# Altium project lab2_demcheva_buck.PrjPcb
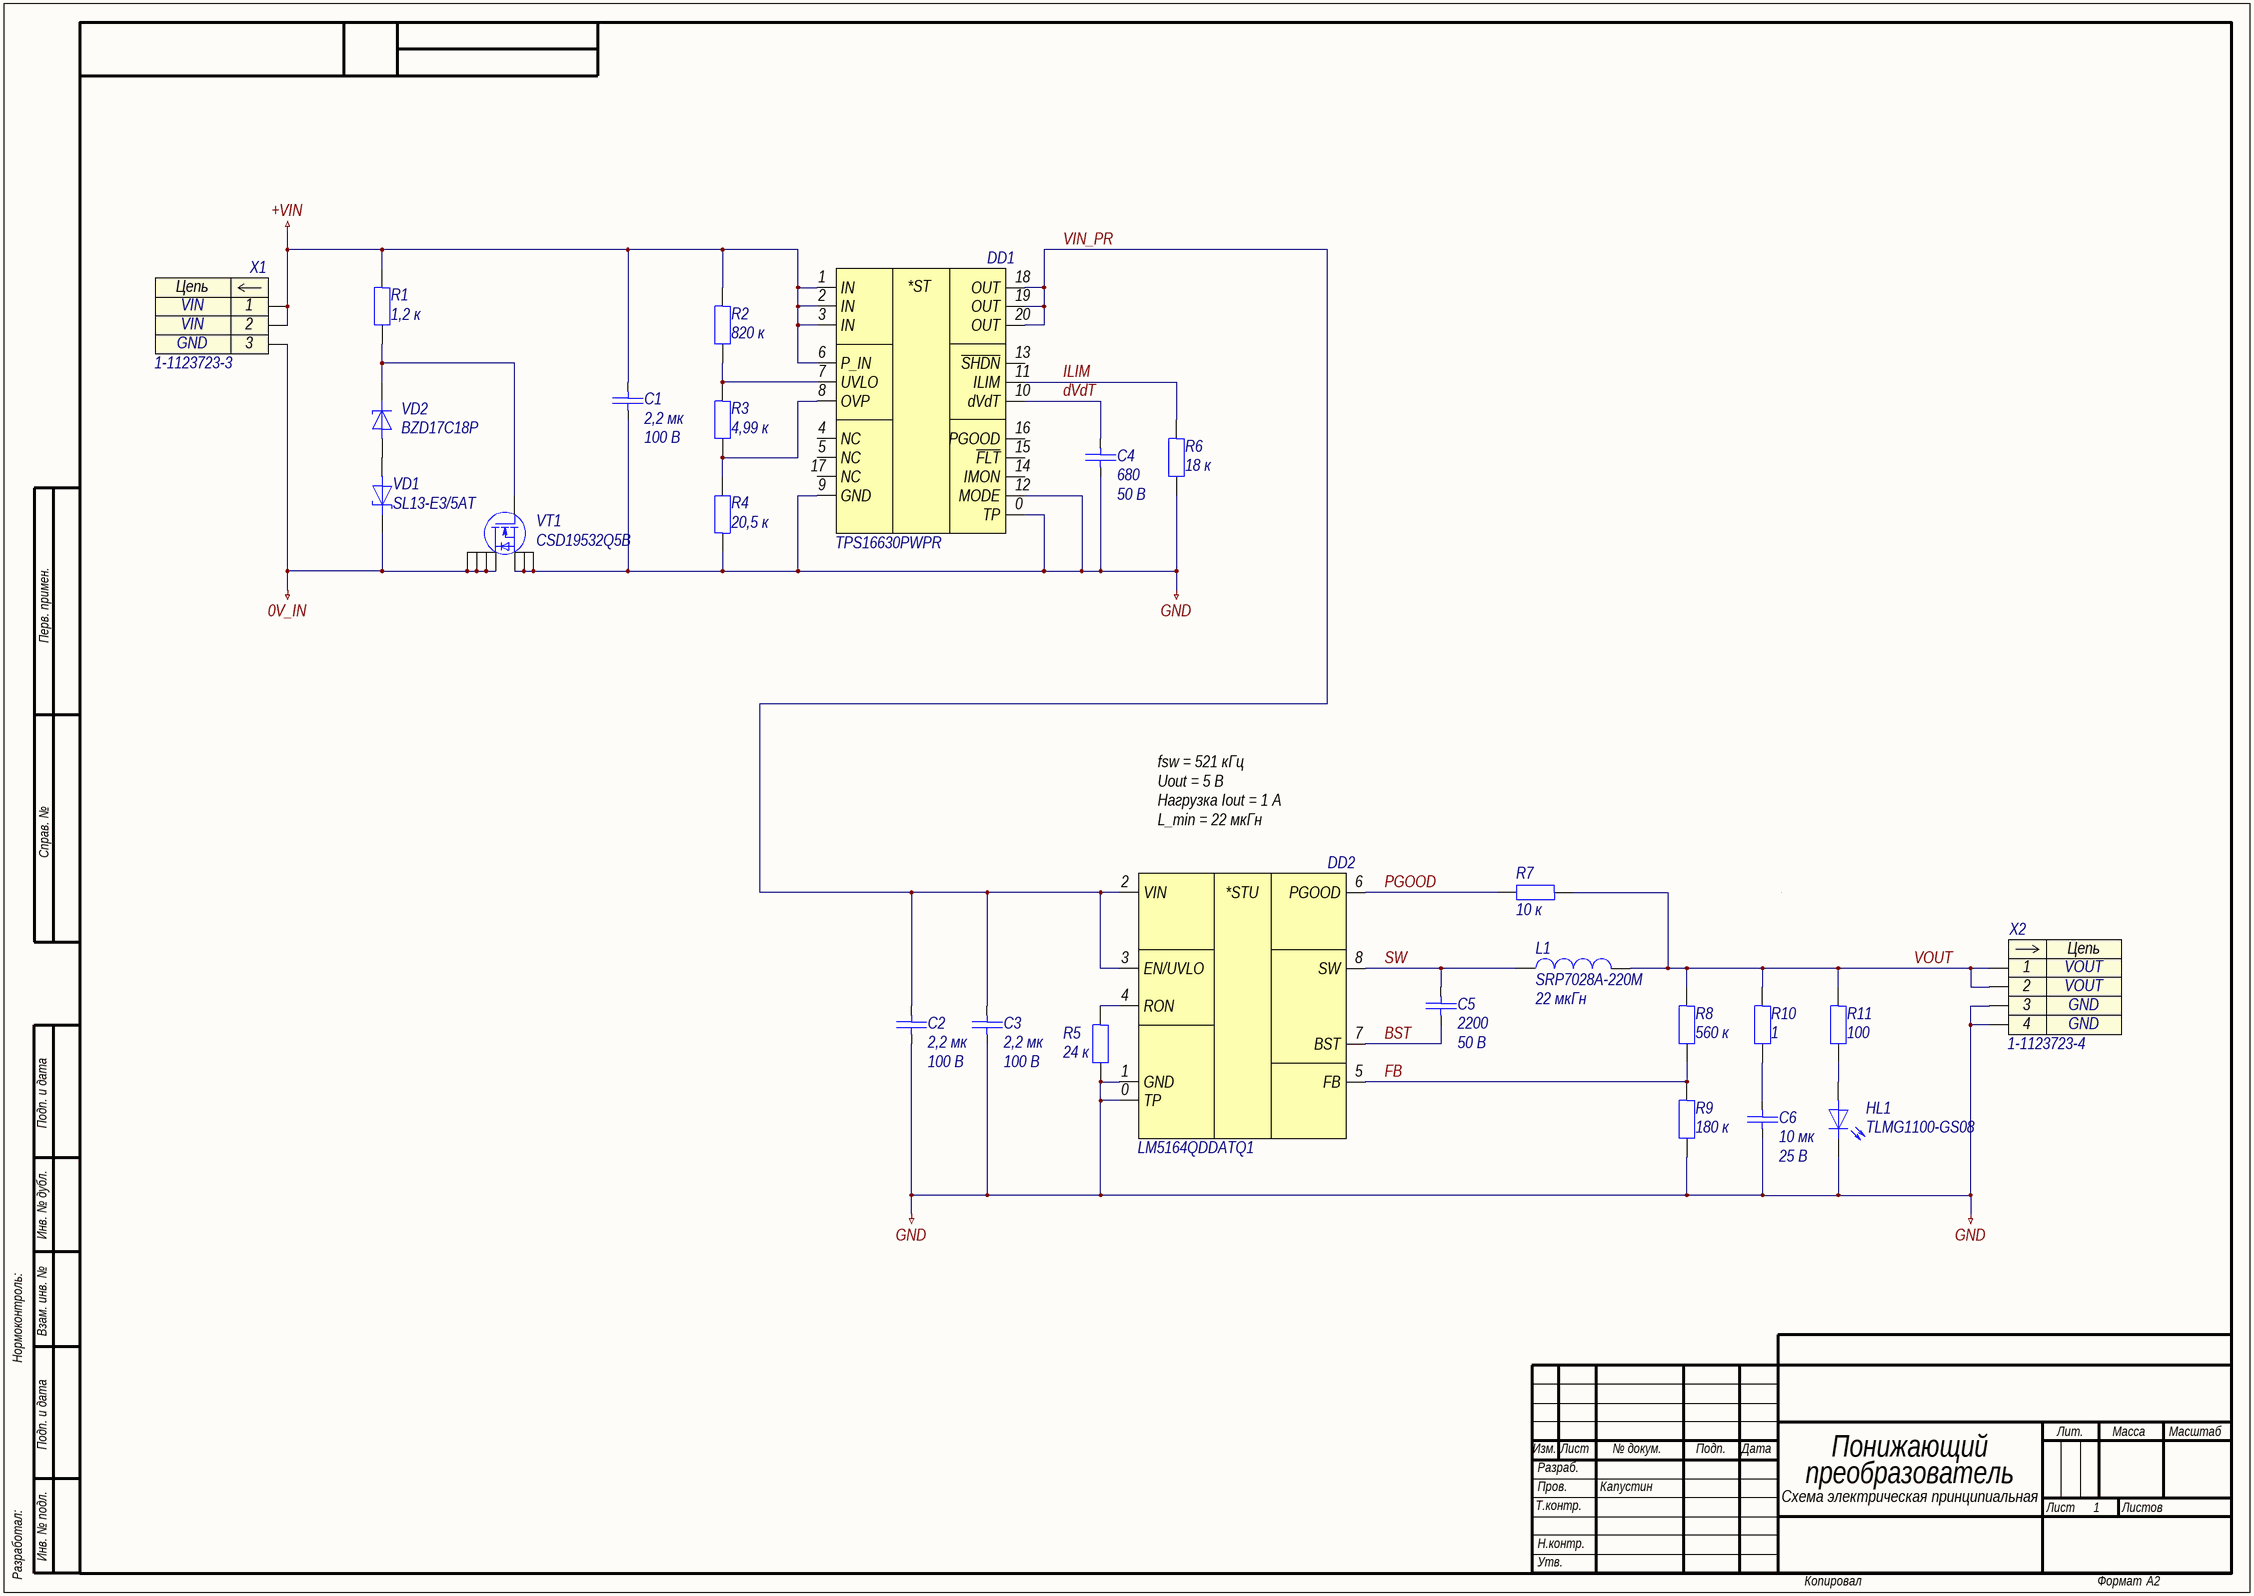
[diagram p0: lab2_demcheva_buck.SchDoc]
approver: Капустин; check: Капустин; designation: СПБПУ.3331506.002; developer: Демчева; document_code: Ý3; document_type: Схема электрическая принципиальная; letter: 1; pcb_dec_number: СПБПУ.3331506.002; project: Понижающий преобразователь; sheets_total: 1; title: Понижающий преобразователь; title_line_1: Понижающий; title_line_2: преобразователь
1 sheet, 26 parts. Net scope: global (net labels, ports and power ports of the same name join across sheets).
Board file: lab2_demcheva_buck.PcbDoc

## Sheet lab2_demcheva_buck.SchDoc: Понижающий преобразователь
size 594 x 420 mm; ApprovedBy: Капустин; CheckedBy: Капустин; DrawnBy: Демчева; DocumentNumber: СПБПУ.3331506.002Ý3; SheetNumber: 1; SheetTotal: 1; DocumentCode: Ý3; ImagePath: СПБПУ.3331506.002

### Parts
C1  2,2 мк  Напряжение: 100 В  [C1206]
C2  2,2 мк  Напряжение: 100 В  [C1206]
C3  2,2 мк  Напряжение: 100 В  [C1206]
C4  680  Напряжение: 50 В  [C0603]
C5  2200  Напряжение: 50 В  [C0603]
C6  10 мк  Напряжение: 25 В  [C1206]
DD1  TPS16630PWPR  [HTSSOP-20]
DD2  LM5164QDDATQ1  [HSOIC-8]
HL1  TLMG1100-GS08  [HL0603]
L1  SRP7028A-220M  Индуктивность: 22 мкГн  [SRP-2-670X660X280]
R1  1,2 к  [R0603]
R2  820 к  [R0603]
R3  4,99 к  [R0603]
R4  20,5 к  [R0603]
R5  24 к  [R0603]
R6  18 к  [R0603]
R7  10 к  [R0603]
R8  560 к  [R0603]
R9  180 к  [R0603]
R10  1  [R0603]
R11  100  [R0603]
VD1  SL13-E3/5AT  [DO-214AC]
VD2  BZD17C18P  [DO-219AB]
VT1  CSD19532Q5B  [SON-8]
X1  1-1123723-3  [1-1123723-3]
X2  1-1123723-4  [1-1123723-4]

### Nets
0V_IN: VD1.1 VT1.D X1.3
+VIN: C1.2 DD1.1(IN) DD1.2(IN) DD1.3(IN) DD1.6(P_IN) R1.1 R2.1 X1.1 X1.2
GND: C1.1 C2.1 C3.1 C4.1 C6.1 DD1.0(TP) DD1.9(GND) DD1.12(MODE) DD2.0(TP) DD2.1(GND) HL1.1 R4.1 R5.2 R6.2 R9.2 VT1.S X2.3 X2.4
BST: C5.1 DD2.7(BST)
dVdT: C4.2 DD1.10(dVdT)
FB: DD2.5(FB) R8.2 R9.1
ILIM: DD1.11(ILIM) R6.1
PGOOD: DD2.6(PGOOD) R7.2
SW: C5.2 DD2.8(SW) L1.1
VIN_PR: C2.2 C3.2 DD1.18(OUT) DD1.19(OUT) DD1.20(OUT) DD2.2(VIN) DD2.3(EN/UVLO)
VOUT: L1.2 R7.1 R8.1 R10.1 R11.1 X2.1 X2.2
NetC6_2: C6.2 R10.2
NetDD1_7: DD1.7(UVLO) R2.2 R3.1
NetDD1_8: DD1.8(OVP) R3.2 R4.2
NetDD2_4: DD2.4(RON) R5.1
NetHL1_2: HL1.2 R11.2
NetR1_2: R1.2 VD2.1 VT1.G
NetVD1_2: VD1.2 VD2.2

Not connected (* = marked no-connect by the designer): DD1 4(NC) 5(NC) 13(~{SHDN}) 14(IMON) 15(~{FLT}) 16(PGOOD) 17(NC)

### Notes on the sheet
- fsw = 521 кГц
  Uout = 5 В
  Нагрузка Iout = 1 А
  L_min = 22 мкГн
- Перв. примен.
- Справ. №
- Подп. и дата
- Инв. № дубл.
- Нормоконтроль:
- Взам. инв. №
- Изм.
- Лист
- № докум.
- Подп.
- Дата
- Лит.
- Масса
- Масштаб
- Т.контр.
- Пров.
- Разраб.
- Листов
- Разработал:
- Инв. № подл.
- Н.контр.
- Утв.
- Копировал
- Формат
- А2
- (in symbol dd0002) *ST
- (in symbol dd0010) *STU
- (in symbol x0006) Цепь
- (in symbol x0007) Цепь

### Library data of the parts
C1 = c0077: =Описание; ID: c0077; Фамилия: Ларионов; Описание: Конденсатор чип 1206 2,2 мкФ 100 В ±10 %; Наименование: CC1206KKX7R0BB225; Производитель: YAGEO Corp.; Отклонение: ±10 %; Рабочие температуры: от –55 °С до +125 °С; Температурный коэффициент емкости: X7R; Корпус: 1206; Номинал: 2,2 мк; Номинальное напряжение: 100 В; HelpURL: https://www.yageo.com/upload/media/product/productsearch/datasheet/mlcc/UPY-NP0X7R_MV_100-to-630V_22.pdf
C2 C3 = c0076: =Описание; ID: c0076; Фамилия: Ларионов; Описание: Конденсатор чип 1206 2,2 мкФ 100 В ±10 %; Наименование: CC1206KKX7R0BB225; Производитель: YAGEO Corp.; Отклонение: ±10 %; Рабочие температуры: от –55 °С до +125 °С; Температурный коэффициент емкости: X7R; Корпус: 1206; Номинал: 2,2 мк; Номинальное напряжение: 100 В; HelpURL: https://www.yageo.com/upload/media/product/productsearch/datasheet/mlcc/UPY-NP0X7R_MV_100-to-630V_22.pdf
C4 = c0005: =Описание; ID: c0005; Фамилия: Демчева; Описание: Конденсатор чип 0603 680 пФ 50 В ±5 %; Наименование: CC0603JRX7R9BB681; Производитель: YAGEO Corp.; Отклонение: ±5 %; Рабочие температуры: от –55 °С до +125 °С; Температурный коэффициент емкости: X7R; Корпус: 0603; Номинал: 680; Номинальное напряжение: 50 В; HelpURL: https://www.yageo.com/upload/media/product/productsearch/datasheet/mlcc/UPY-GPHC_X7R_6.3V-to-50V_20.pdf
C5 = c0019: =Описание; ID: c0019; Фамилия: Паньков; Описание: Конденсатор чип 0603 2,2 нФ 50 В ±10 %; Наименование: CC0603KRX7R9BB222; Производитель: YAGEO Corp.; Отклонение: ±10 %; Рабочие температуры: от –55 °С до +125 °С; Температурный коэффициент емкости: X7R; Корпус: 0603; Номинал: 2200; Номинальное напряжение: 50 В; HelpURL: https://www.yageo.com/upload/media/product/products/datasheet/mlcc/UPY-GPHC_X7R_6.3V-to-50V_20.pdf
C6 = c0095: =Описание; ID: c0095; Фамилия: Паньков; Описание: Конденсатор чип 1206 10 мкФ 25 В ±10 %; Наименование: CC1206KRX7R8BB106; Производитель: YAGEO Corp.; Отклонение: ±10 %; Рабочие температуры: от –55 °С до +125 °С; Температурный коэффициент емкости: X7R; Корпус: 1206; Номинал: 10 мк; Номинальное напряжение: 25 В; HelpURL: https://www.yageo.com/upload/media/product/productsearch/datasheet/mlcc/UPY-GPHC_X7R_6.3V-to-50V_20.pdf
DD1 = dd0002: =Описание; ID: dd0002; Фамилия: Жернаков; Описание: Защитная микросхема eFuse 60 В и 6 А; Производитель: Texas Instruments; Напряжение: от 4,5 В до 60 В; Максимальное напряжение: 67 В; Ток: от 0,6 А до 6 А; Рабочие температуры: от -40 °С до +125 °С; Наименование: TPS16630PWPR; Корпус: HTSSOP-20; HelpURL: https://www.ti.com/product/TPS1663
DD2 = dd0010: =Описание; ID: dd0010; Фамилия: Демчева; Наименование: LM5164QDDATQ1; HelpURL: https://www.ti.com/product/LM5164-Q1
HL1 = hl0005: =Описание; ID: hl0005; Фамилия: Ларионов; Описание: Светодиод чип 0603 зеленый; Производитель: Vishay Intertechnology, Inc.; Цвет: Green; Номинальная сила света: 35 мкд; Номинальная длина волны: 570 нм; Номинальный прямой ток: 30 мА; Номинальное падение напряжения: 2,1 В; Рассеиваемая мощность: 90 мВт; Рабочие температуры: от -40 °С до +100 °С; Корпус: 0603; Наименование: TLMG1100-GS08; HelpURL: https://www.vishay.com/leds/list/product-83173/
L1 = l0006: =Описание; ID: l0006; Фамилия: Ларионов; Описание: Катушка индуктивности 22 мкГн ±20 %; Производитель: Bourns, Inc.; Отклонение: ±20 %; Номинальное активное сопротивление: 165 мОм; Максимальное активное сопротивление: 190 мОм; Резонансная частота: 10 МГц; Номинальный ток (при нагреве на 20 °С/40 °С): 2 А; Ток насыщения: 3,5 А; Рабочее напряжение: не указано; Рабочие температуры: от –55 °С до +150 °С; Корпус: 6,7 x 6,6 x 2,8; Наименование: SRP7028A-220M; Номинал: 22 мкГн; HelpURL: https://www.bourns.com/products/magnetic-products/power-inductors-aec-q200-compliant/product/SRP7028A
R1 = r0034: =Описание; ID: r0034; Фамилия: Паньков; Описание: Резистор чип 0603 1,2 кОм ±1 % 0,1 Вт; Наименование: RC0603FR-071K2L; Производитель: YAGEO Corp.; Отклонение: ±1 %; Номинальное напряжение: 75 В; Рабочие температуры: от –55 °С до +155 °С; Номинальный ток: 1 А; Корпус: 0603; Номинал: 1,2 к; HelpURL: https://www.yageo.com/upload/media/product/productsearch/datasheet/rchip/PYu-RC_Group_51_RoHS_L_11.pdf
R2 = r0124: =Описание; ID: r0124; Фамилия: Паньков; Описание: Резистор чип 0603 820 кОм ±1 % 0,1 Вт; Наименование: RC0603FR-07820KL; Производитель: YAGEO Corp.; Отклонение: ±1 %; Номинальное напряжение: 75 В; Рабочие температуры: от –55 °С до +155 °С; Номинальный ток: 1 А; Корпус: 0603; Примечание: Ряд E24; Номинал: 820 к; HelpURL: https://www.yageo.com/upload/media/product/productsearch/datasheet/rchip/PYu-RC_Group_51_RoHS_L_11.pdf
R3 = r0050: =Описание; ID: r0050; Фамилия: Жернаков; Описание: Резистор чип 0603 4,99 кОм ±1 % 0,1 Вт; Наименование: RC0603FR-074K99L; Производитель: YAGEO Corp.; Отклонение: ±1 %; Номинальное напряжение: 75 В; Рабочие температуры: от –55 °С до +155 °С; Номинальный ток: 1 А; Корпус: 0603; Номинал: 4,99 к; HelpURL: https://www.yageo.com/upload/media/product/productsearch/datasheet/rchip/PYu-RC_Group_51_RoHS_L_11.pdf
R4 = r0071: =Описание; ID: r0071; Фамилия: Демчева; Описание: Резистор чип 0603 20,5 кОм  ±1 % 0,1 Вт; Наименование: RC0603FR-0720K5L; Производитель: YAGEO Corp.; Отклонение: ±1 %; Номинальное напряжение: 75 В; Рабочие температуры: от –55 °С до +155 °С; Номинальный ток: 1 А; Корпус: 0603; Номинал: 20,5 к; HelpURL: https://ru.mouser.com/ProductDetail/Yageo/RC0603FR-0720K5L/?qs=VU8sRB4EgwDkGE%252BE2CpPDg%3D%3D
R5 = r0072: =Описание; ID: r0072; Фамилия: Паньков; Описание: Резистор чип 0603 24 кОм ±1 % 0,1 Вт; Наименование: RC0603FR-0724KL; Производитель: YAGEO Corp.; Отклонение: ±1 %; Номинальное напряжение: 75 В; Рабочие температуры: от –55 °С до +155 °С; Номинальный ток: 1 А; Корпус: 0603; Номинал: 24 к; HelpURL: https://www.yageo.com/upload/media/product/productsearch/datasheet/rchip/PYu-RC_Group_51_RoHS_L_11.pdf
R6 = r0068: =Описание; ID: r0068; Фамилия: Паньков; Описание: Резистор чип 0603 18 кОм ±1 % 0,1 Вт; Наименование: RC0603FR-0718KL; Производитель: YAGEO Corp.; Отклонение: ±1 %; Номинальное напряжение: 75 В; Рабочие температуры: от –55 °С до +155 °С; Номинальный ток: 1 А; Корпус: 0603; Примечание: Ряд E24; Номинал: 18 к; HelpURL: https://www.yageo.com/upload/media/product/productsearch/datasheet/rchip/PYu-RC_Group_51_RoHS_L_11.pdf
R7 = r0060: =Описание; ID: r0060; Фамилия: Самарин; Описание: Резистор чип 0603 10 кОм ±1 % 0,1 Вт; Наименование: RC0603FR-0710KL; Производитель: YAGEO Corp.; Отклонение: ±1 %; Номинальное напряжение: 75 В; Рабочие температуры: от –55 °С до +155 °С; Номинальный ток: 1 А; Корпус: 0603; Примечание: Ряд E24; Номинал: 10 к; HelpURL: https://www.yageo.com/upload/media/product/productsearch/datasheet/rchip/PYu-RC_Group_51_RoHS_L_11.pdf
R8 = r0120: =Описание; ID: r0120; Фамилия: Паньков; Описание: Резистор чип 0603 560 кОм ±1 % 0,1 Вт; Наименование: RC0603FR-07560KL; Производитель: YAGEO Corp.; Отклонение: ±1 %; Номинальное напряжение: 75 В; Рабочие температуры: от –55 °С до +155 °С; Номинальный ток: 1 А; Корпус: 0603; Номинал: 560 к; HelpURL: https://www.yageo.com/upload/media/product/productsearch/datasheet/rchip/PYu-RC_Group_51_RoHS_L_11.pdf
R9 = r0105: =Описание; ID: r0105; Фамилия: Паньков; Описание: Резистор чип 0603 180 кОм ±1 % 0,1 Вт; Наименование: RC0603FR-07180KL; Производитель: YAGEO Corp.; Отклонение: ±1 %; Номинальное напряжение: 75 В; Рабочие температуры: от –55 °С до +155 °С; Номинальный ток: 1 А; Корпус: 0603; Номинал: 180 к; HelpURL: https://www.yageo.com/upload/media/product/productsearch/datasheet/rchip/PYu-RC_Group_51_RoHS_L_11.pdf
R10 = r0002: =Описание; ID: r0002; Фамилия: Ларионов; Описание: Резистор чип 0603 1 Ом ±1 % 0,1 Вт; Наименование: RC0603FR-071RL; Производитель: YAGEO Corp.; Отклонение: ±1 %; Номинальное напряжение: 75 В; Рабочие температуры: от –55 °С до +155 °С; Номинальный ток: 1 А; Корпус: 0603; Номинал: 1; HelpURL: https://www.yageo.com/upload/media/product/productsearch/datasheet/rchip/PYu-RC_Group_51_RoHS_L_11.pdf
R11 = r0007: =Описание; ID: r0007; Фамилия: Самарин; Описание: Резистор чип 0603 100 Ом ±1 % 0,1 Вт; Наименование: RC0603FR‍‐07100RL; Производитель: YAGEO Corp.; Отклонение: ±1 %; Номинальное напряжение: 75 В; Рабочие температуры: от –55 °С до +155 °С; Номинальный ток: 1 А; Корпус: 0603; Примечание: Ряд E24; Номинал: 100; HelpURL: https://www.yageo.com/upload/media/product/productsearch/datasheet/rchip/PYu-RC_Group_51_RoHS_L_11.pdf
VD1 = vd0002: =Описание; ID: vd0002; Фамилия: Ларионов; Описание: Диод Шоттки 30 В 1,5 А; Производитель: Vishay Intertechnology, Inc.; Пиковое прямое напряжение: 0,445 В; Импульсное обратное напряжение: 30 В; Макс допустимый средний прямой ток: 1,5 А; Рабочие температуры: от –55 °С до +125 °С; Наименование: SL13-E3/5AT; Корпус: DO-214AC; HelpURL: https://www.vishay.com/product?docid=88740
VD2 = vd0018: =Описание; ID: vd0018; Фамилия: Паньков; Описание: Стабилитрон 18 В; Производитель: Vishay Intertechnology, Inc.; Номинальное напряжение стабилизации: 18 В; Разброс напряжения стабилизации: 16,8...19,1 В; Номинальный ток стабилизации: 25 мА; Рабочие температуры: от –55 °С до +150 °С; Наименование: BZD17C18P; Корпус: DO-219AB; HelpURL: https://www.vishay.com/product?docid=85161
VT1 = vt0001: =Описание; ID: vt0001; Фамилия: Жернаков; Описание: Транзистор полевой N-канальный 100 В 17 А; Производитель: Texas Instruments; Напряжение затвор — исток: ±20 В; Напряжение сток — исток: 100 В; Ток стока: 17 А; Сопротивление сток — исток: 0,0057 Ом; Рабочие температуры: от –55 °С до +150 °С; Наименование: CSD19532Q5B; Корпус: SON-8; HelpURL: https://www.ti.com/product/CSD19532Q5B
X1 = x0006: =Описание; Contact_1: VIN; Contact_3: GND; ID: x0006; Фамилия: Ларионов; Описание: Economy Power 3 pin 3,96 мм вилка прямой; Производитель: TE Connectivity; Contact_2: VIN; Наименование: 1-1123723-3; HelpURL: https://www.te.com/usa-en/product-1-1123723-3.html
X2 = x0007: =Описание; Contact_1: VOUT; Contact_3: GND; ID: x0007; Фамилия: Ларионов; Описание: Economy Power 4 pin 3,96 мм вилка прямой; Производитель: TE Connectivity; Contact_2: VOUT; Contact_4: GND; Наименование: 1-1123723-4; HelpURL: https://www.te.com/usa-en/product-1-1123723-4.html